# EAGLE design wemos_gpio (EAGLE 8.3.2)
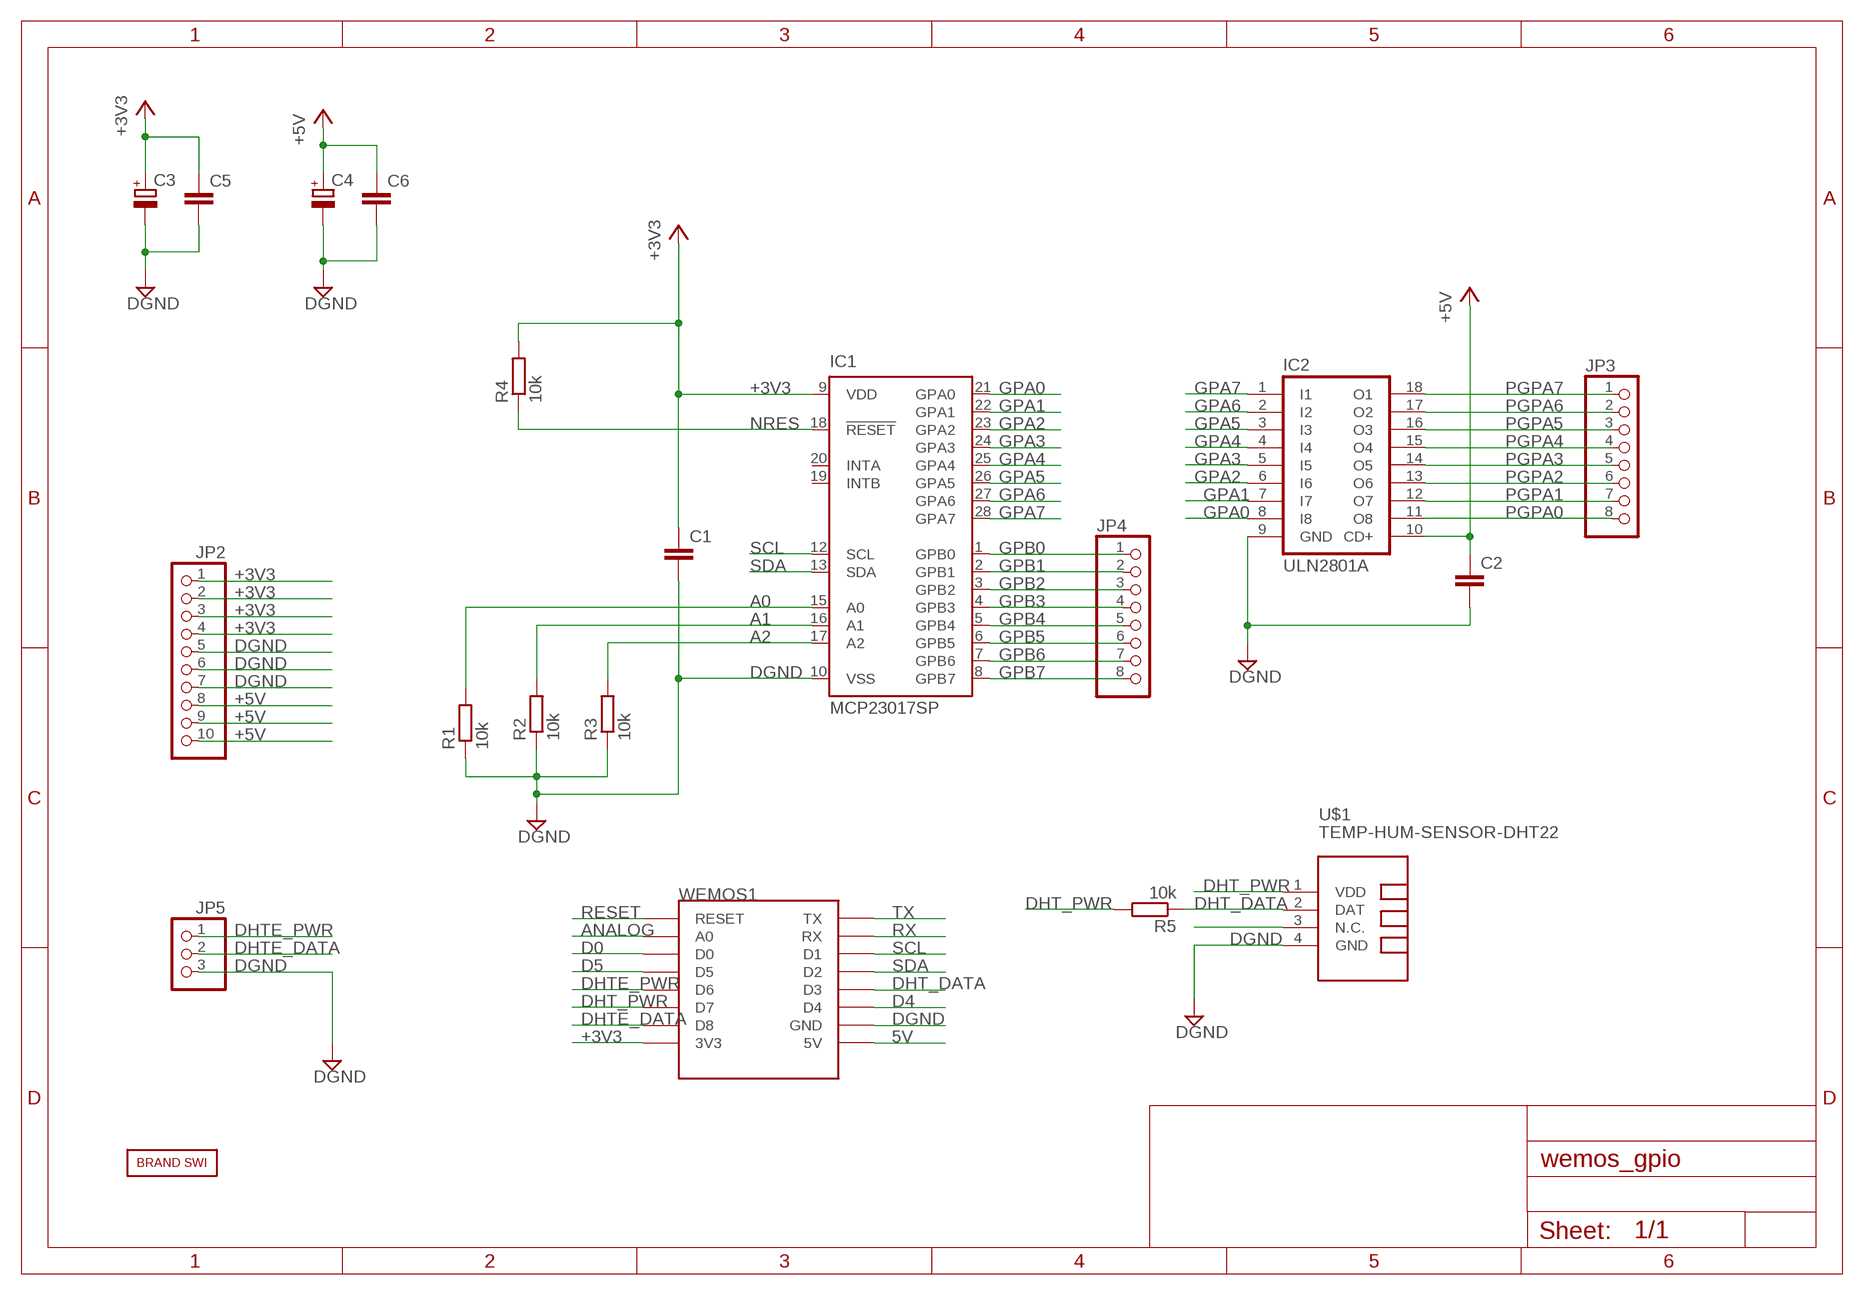
[diagram p0: schematic, sheet 1]

## Parts
C1  C-EUC1210  [C1210]
C2  C-EUC1210  [C1210]
C3  CPOL-EUTT5D7  [TT5D7]
C4  CPOL-EUTT5D7  [TT5D7]
C5  C-EUC1210  [C1210]
C6  C-EUC1210  [C1210]
IC1  MCP23017SP  [DIL28-3]
IC2  ULN2801A  [DIL18]
JP2  PINHD-1X10  [1X10]
JP3  PINHD-1X8  [1X08]
JP4  PINHD-1X8  [1X08]
JP5  PINHD-1X3  [1X03]
R1  10k  R-EU_M1206  [M1206]
R2  10k  R-EU_M1206  [M1206]
R3  10k  R-EU_M1206  [M1206]
R4  10k  R-EU_M1206  [M1206]
R5  10k  R-EU_M1206  [M1206]
U$1  TEMP-HUM-SENSOR-DHT22  [TEMP-HUM-SENSOR-DHT22]
U$2  BRAND_SWI5X7  [BRAND_SWI_5X7]
WEMOS1  WEMOS-D1-MINI  [WEMOS-D1-MINI]

## Nets
5V: WEMOS1.5V
+3V3: C1.1 C3.+ C5.1 IC1.9(VDD) JP2.1 JP2.2 JP2.3 JP2.4 R4.2 WEMOS1.3V3
+5V: C2.1 C4.+ C6.1 IC2.10(CD+) JP2.8 JP2.9 JP2.10
A0: IC1.15(A0) R1.2
A1: IC1.16(A1) R2.2
A2: IC1.17(A2) R3.2
ANALOG: WEMOS1.A0
D0: WEMOS1.D0
D4: WEMOS1.D4
D5: WEMOS1.D5
DGND: C1.2 C2.2 C3.- C4.- C5.2 C6.2 IC1.10(VSS) IC2.9(GND) JP2.5 JP2.6 JP2.7 JP5.3 R1.1 R2.1 R3.1 U$1.4(GND) WEMOS1.GND
DHT_DATA: R5.1 U$1.2(DAT) WEMOS1.D3
DHT_PWR: R5.2 U$1.1(VDD) WEMOS1.D7
DHTE_DATA: JP5.2 WEMOS1.D8
DHTE_PWR: JP5.1 WEMOS1.D6
GPA0: IC1.21(GPA0) IC2.8(I8)
GPA1: IC1.22(GPA1) IC2.7(I7)
GPA2: IC1.23(GPA2) IC2.6(I6)
GPA3: IC1.24(GPA3) IC2.5(I5)
GPA4: IC1.25(GPA4) IC2.4(I4)
GPA5: IC1.26(GPA5) IC2.3(I3)
GPA6: IC1.27(GPA6) IC2.2(I2)
GPA7: IC1.28(GPA7) IC2.1(I1)
GPB0: IC1.1(GPB0) JP4.1
GPB1: IC1.2(GPB1) JP4.2
GPB2: IC1.3(GPB2) JP4.3
GPB3: IC1.4(GPB3) JP4.4
GPB4: IC1.5(GPB4) JP4.5
GPB5: IC1.6(GPB5) JP4.6
GPB6: IC1.7(GPB6) JP4.7
GPB7: IC1.8(GPB7) JP4.8
N$3: U$1.3(N.C.)
NRES: IC1.18(!RESET) R4.1
PGPA0: IC2.11(O8) JP3.8
PGPA1: IC2.12(O7) JP3.7
PGPA2: IC2.13(O6) JP3.6
PGPA3: IC2.14(O5) JP3.5
PGPA4: IC2.15(O4) JP3.4
PGPA5: IC2.16(O3) JP3.3
PGPA6: IC2.17(O2) JP3.2
PGPA7: IC2.18(O1) JP3.1
RESET: WEMOS1.RESET
RX: WEMOS1.RX
SCL: IC1.12(SCL) WEMOS1.D1
SDA: IC1.13(SDA) WEMOS1.D2
Unconnected: IC1.19(INTB) IC1.20(INTA) WEMOS1.TX

## Library data of the parts
C1 C2 C5 C6 = rcl:C-EU: CAPACITOR, European symbol
C3 C4 = rcl:CPOL-EU: POLARIZED CAPACITOR, European symbol
IC1 = SWI_COMMONS:MCP23017: http://ww1.microchip.com/downloads/en/DeviceDoc/21952a.pdf Source: http://ww1.microchip.com/downloads/en/DeviceDoc/21952a.pdf; MF: MICROCHIP; MPN: MCP23017-E/SP; OC_FARNELL: 1332088; OC_NEWARK: 31K2959
IC2 = uln-udn:ULN2801A: DRIVER ARRAY
JP2 = pinhead:PINHD-1X10: PIN HEADER
JP3 JP4 = pinhead:PINHD-1X8: PIN HEADER
JP5 = pinhead:PINHD-1X3: PIN HEADER
R1-R5 = rcl:R-EU_: RESISTOR, European symbol
U$1 = SWI_COMMONS:TEMP-HUM-SENSOR-DHT22: DHT22 - digital humidity & temperature sensor Also known as: AM2302 AM2302 datasheet available here: http://akizukidenshi.com/download/ds/aosong/AM2302.pdf Click here to find device on ebay.com <http://www.ebay.com/sch/dht22+digital+sensor>
U$2 = BRAND_SWI:BRAND_SWI
WEMOS1 = SWI_COMMONS:WEMOS-D1-MINI: WeMos.cc D1 mini ESP8266 module

## Board
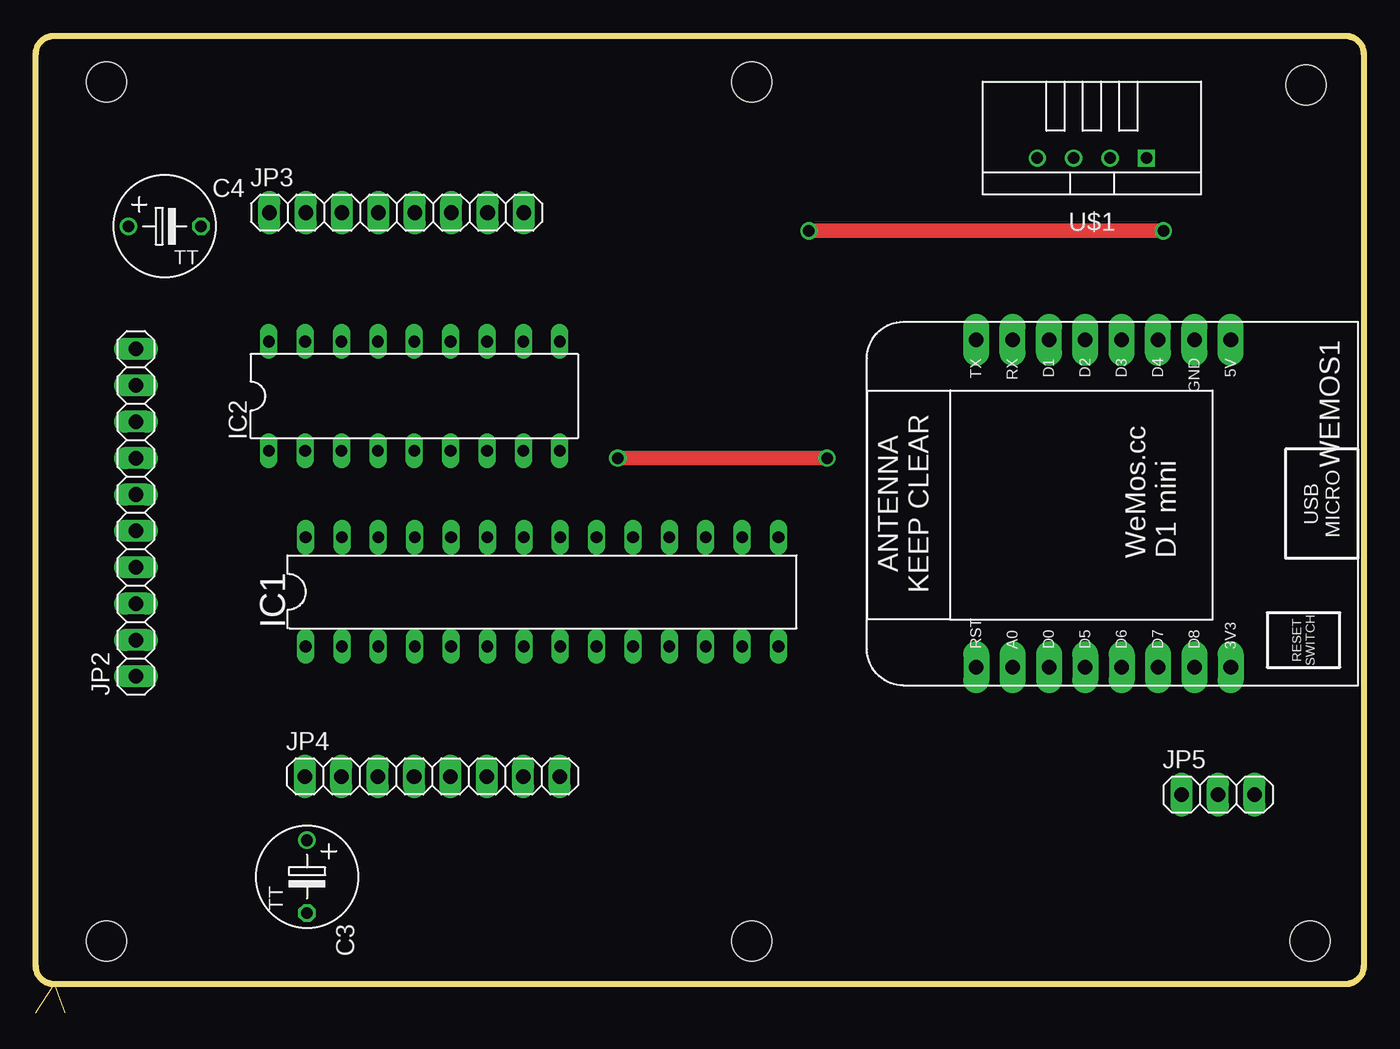
[diagram p1: board, top side]
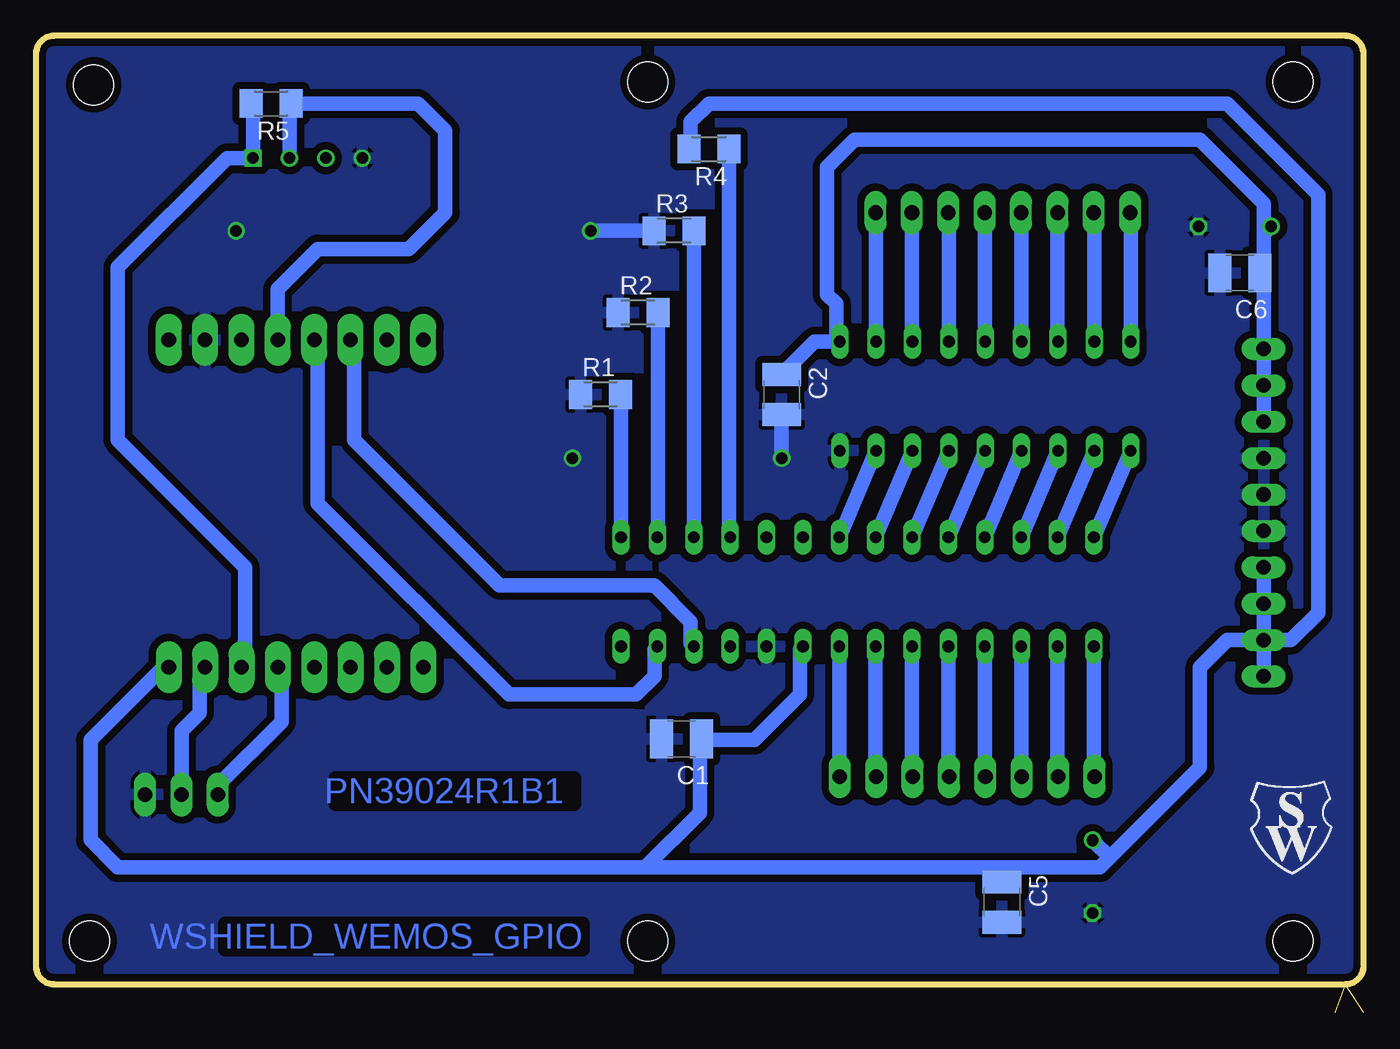
[diagram p2: board, bottom side, seen from below]

Size 92.72 x 68.23 mm. Coordinates in mm from the lower left corner, seen from the top.
Outline: 0,0 1.27,2
Outline: 1.27,2 2.03,0
Outline: 1.27,2 91.45,2 arc90 92.72,3.27 92.72,66.96 arc90 91.45,68.23 1.27,68.23 arc90 0,66.96 0,3.27 arc90 1.27,2
Copper layers (1*16): Top 0.035mm / dielectric 1.6mm / Bottom 0.035mm
Design rules "Elecrow_2-layer_PCB_eagle_rule *": minimum track width 12mil, minimum drill 12mil, track to track 6mil, track to pad 6mil, pad to pad 6mil, via to via 8mil, smd to smd 0mil, copper to edge 20mil, drill to drill 10mil, minimum pad ring 6mil, minimum via ring 6mil, stop-mask expansion 0mil, vias tented up to drill 100mil, thermal gap 10mil
Holes 2.8 mm at 4.94,65.02 4.94,5.01 88.98,5.01 88.68,64.81 49.98,65.01 49.98,5.01

### Footprints (pad centres in the part's own frame; a part is rotated, then mirrored left to right if it is on the bottom)
C1210 = smd 1.6 x 2.7: 1 -1.4,0; 2 1.4,0
TT5D7 = drill 0.813: + -2.54,0 | drill 0.813 octagon: - 2.54,0
DIL28-3 = drill 0.813 long: 1 -16.51,-3.81; 2 -13.97,-3.81; 3 -11.43,-3.81; 4 -8.89,-3.81; 5 -6.35,-3.81; 6 -3.81,-3.81; 7 -1.27,-3.81; 8 1.27,-3.81; 9 3.81,-3.81; 10 6.35,-3.81; 11 8.89,-3.81; 12 11.43,-3.81; 13 13.97,-3.81; 14 16.51,-3.81; 15 16.51,3.81; 16 13.97,3.81; 17 11.43,3.81; 18 8.89,3.81; 19 6.35,3.81; 20 3.81,3.81; 21 1.27,3.81; 22 -1.27,3.81; 23 -3.81,3.81; 24 -6.35,3.81; 25 -8.89,3.81; 26 -11.43,3.81; 27 -13.97,3.81; 28 -16.51,3.81
DIL18 = drill 0.813 long: 1 -10.16,-3.81; 2 -7.62,-3.81; 3 -5.08,-3.81; 4 -2.54,-3.81; 5 0,-3.81; 6 2.54,-3.81; 7 5.08,-3.81; 8 7.62,-3.81; 9 10.16,-3.81; 10 10.16,3.81; 11 7.62,3.81; 12 5.08,3.81; 13 2.54,3.81; 14 0,3.81; 15 -2.54,3.81; 16 -5.08,3.81; 17 -7.62,3.81; 18 -10.16,3.81
1X10 = drill 1.016 long: 1 -11.43,0; 2 -8.89,0; 3 -6.35,0; 4 -3.81,0; 5 -1.27,0; 6 1.27,0; 7 3.81,0; 8 6.35,0; 9 8.89,0; 10 11.43,0
1X08 = drill 1.016 long: 1 -8.89,0; 2 -6.35,0; 3 -3.81,0; 4 -1.27,0; 5 1.27,0; 6 3.81,0; 7 6.35,0; 8 8.89,0
1X03 = drill 1.016 long: 1 -2.54,0; 2 0,0; 3 2.54,0
M1206 = smd 1.6 x 2: 1 -1.4,0; 2 1.4,0
TEMP-HUM-SENSOR-DHT22 = drill 0.8 square: 1 -3.81,0 | drill 0.8: 2 -1.27,0; 3 1.27,0; 4 3.81,0
WEMOS-D1-MINI = drill 1.016 pad 1.829 long: 3V3 -10.16,-10.16; 5V 12.7,-10.16; A0 -10.16,5.08; D0 -10.16,2.54; D1 12.7,2.54; D2 12.7,0; D3 12.7,-2.54; D4 12.7,-5.08; D5 -10.16,0; D6 -10.16,-2.54; D7 -10.16,-5.08; D8 -10.16,-7.62; GND 12.7,-7.62; RESET -10.16,7.62; RX 12.7,5.08; TX 12.7,7.62

### Placement (x,y rotation side)
C1  47.62,19.13 180 bottom
C2  40.64,43.18 270 bottom
C3  18.94,9.51 270 top
C4  9,54.93 0 top
C5  25.26,7.73 270 bottom
C6  8.65,51.67 180 bottom
IC1  35.35,29.4 0 top
IC2  26.43,43.07 0 top
JP2  6.99,34.92 90 top
JP3  25.2,55.88 0 top
JP4  27.69,16.51 0 top
JP5  82.55,15.24 0 top
R1  53.29,43.18 0 bottom
R2  50.67,48.9 0 bottom
R3  48.16,54.61 0 bottom
R4  45.72,60.33 180 bottom
R5  76.28,63.5 180 bottom
U$1  73.74,59.69 180 top
U$2  8.13,9.53 0 bottom
WEMOS1  73.28,34.29 90 top

### Tracks (layer width: path | path; a pad name or v marks a point on that pad's centre or on a via)
+3V3
  Bottom 0.813: C1.1 46.15,19.05
  Bottom 1.016: 50.16,10.16 87,10.16 88.9,12.06 88.9,19.05 83.82,24.13 WEMOS1.3V3 | 50.16,10.16 46.35,13.97 46.35,18.84 46.15,19.05 42.55,19.05 39.37,22.23 39.37,25.38 IC1.9 | 50.16,10.16 26.29,10.16 | 26.29,10.16 18.41,10.16 17.73,10.84 | 17.73,10.84 11.43,17.14 11.43,24.13 9.53,26.04 JP2.2 | JP2.4 JP2.3 JP2.2 | JP2.2 JP2.1 | JP2.2 5.08,26.04 3.17,27.94 3.17,57.15 9.53,63.5 45.72,63.5 46.99,62.23 46.99,60.45 R4.2 | 26.29,10.16 C5.1 | C3.+ 17.73,10.84
+5V
  Bottom 0.813: 36.7,46.99 IC2.10
  Bottom 1.016: 6.99,54.07 6.99,56.52 11.43,60.96 35.56,60.96 37.47,59.05 37.47,50.16 36.83,49.53 36.83,47.12 IC2.10 38.34,46.88 C2.1 | 6.99,54.07 JP2.10 JP2.9 JP2.8 | 6.99,54.07 6.99,54.41 C4.+ | 6.99,54.07 6.99,51.94 C6.1
A0
  Bottom 1.016: IC1.15 51.86,43.15 R1.2
A1
  Bottom 1.016: R2.2 49.27,33.25 IC1.16
A2
  Bottom 1.016: IC1.17 46.78,54.59 R3.2
DGND  (via drill 0.8)
  Top 1.016: v40.64,38.73 v55.24,38.73 | v53.98,54.61 v78.74,54.61
  Bottom 1.016: C2.2 v40.64,38.73 | R3.1 v53.98,54.61
  pour Bottom (isolate 0.508): 1.27,2 90.79,2 93.06,3.27 92.06,66.58 90.79,67.85 1.27,67.85 0,66.58 0,3.27
DHT_DATA
  Bottom 1.016: U$1.2 75.01,63.37 R5.1 66.04,63.5 64.14,61.59 64.14,55.88 66.67,53.34 73.03,53.34 75.82,50.55 WEMOS1.D3
DHT_PWR
  Bottom 1.016: WEMOS1.D7 78.11,24.39 78.11,31.11 87,40.01 87,52.07 79.38,59.69 U$1.1 77.55,63.37 R5.2
DHTE_DATA
  Bottom 1.016: JP5.2 82.55,19.68 81.28,20.95 81.28,23.75 WEMOS1.D8
DHTE_PWR
  Bottom 1.016: JP5.1 80.01,15.88 75.56,20.32 75.56,23.88 WEMOS1.D6
GPA0
  Bottom 1.016: IC2.8 IC1.21
GPA1
  Bottom 1.016: IC2.7 IC1.22
GPA2
  Bottom 1.016: IC2.6 IC1.23
GPA3
  Bottom 1.016: IC2.5 IC1.24
GPA4
  Bottom 1.016: IC2.4 IC1.25
GPA5
  Bottom 1.016: IC2.3 IC1.26
GPA6
  Bottom 1.016: IC2.2 IC1.27
GPA7
  Bottom 1.016: IC2.1 IC1.28
GPB0
  Bottom 0.813: 18.84,16.55 JP4.1
  Bottom 1.016: IC1.1 18.84,16.55
GPB1
  Bottom 1.016: IC1.2 21.38,16.55 JP4.2
GPB2
  Bottom 1.016: IC1.3 23.92,16.55 JP4.3
GPB3
  Bottom 1.016: IC1.4 26.46,16.55 JP4.4
GPB4
  Bottom 1.016: IC1.5 29,16.55 JP4.5
GPB5
  Bottom 1.016: IC1.6 31.54,16.55 JP4.6
GPB6
  Bottom 1.016: IC1.7 34.08,16.55 JP4.7
GPB7
  Bottom 0.813: 36.62,16.55 JP4.8
  Bottom 1.016: IC1.8 36.62,16.55
NRES
  Bottom 1.016: R4.1 44.32,33.29 IC1.18
PGPA0
  Bottom 0.813: JP3.8 34.05,55.84
  Bottom 1.016: 34.05,55.84 IC2.11
PGPA1
  Bottom 1.016: JP3.7 31.55,46.92 IC2.12
PGPA2
  Bottom 0.813: JP3.6 28.96,55.84
  Bottom 1.016: 28.96,55.84 IC2.13
PGPA3
  Bottom 1.016: JP3.5 26.47,46.92 IC2.14
PGPA4
  Bottom 0.813: JP3.4 23.89,55.84
  Bottom 1.016: 23.89,55.84 IC2.15
PGPA5
  Bottom 1.016: JP3.3 21.39,46.92 IC2.16
PGPA6
  Bottom 0.813: JP3.2 18.8,55.84
  Bottom 1.016: 18.8,55.84 IC2.17
PGPA7
  Bottom 0.813: JP3.1 16.27,55.84
  Bottom 1.016: 16.27,55.84 IC2.18
SCL
  Bottom 1.016: IC1.12 46.99,25.8 46.99,27.3 49.53,29.84 60.33,29.84 70.48,40.01 70.48,46.73 WEMOS1.D1
SDA
  Bottom 1.016: IC1.13 49.53,25.38 49.53,23.5 50.8,22.23 59.69,22.23 73.03,35.56 73.03,46.73 WEMOS1.D2

### Text on the board
Bottom: PN39024R1B1 | WSHIELD_WEMOS_GPIO